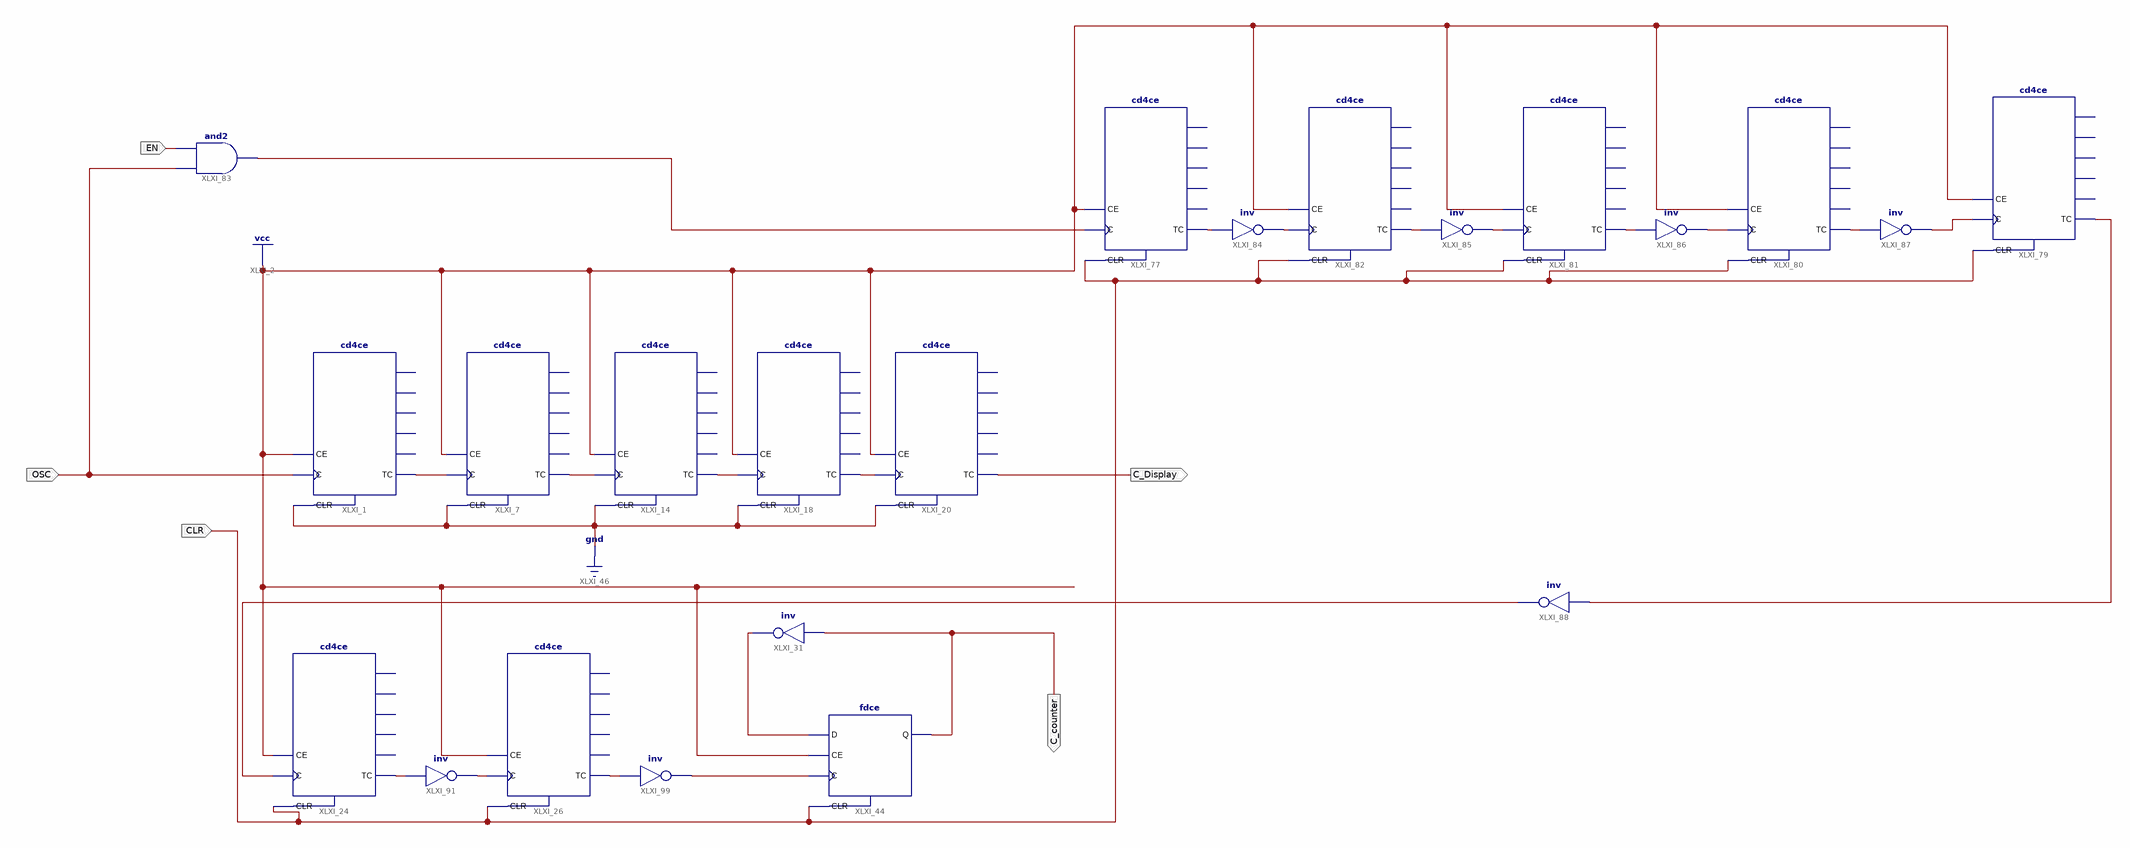
[diagram p0: schematic sheet 1]
// Xilinx ISE schematic DIVx.sch (spartan6) as structural Verilog: 22 symbols, 5 ports
module DIVx (
  input  CLR,
  input  OSC,
  input  EN,
  output C_counter,
  output C_Display
);

  wire XLXN_19, XLXN_20, XLXN_21, XLXN_22, XLXN_227, XLXN_228, XLXN_234, XLXN_235, XLXN_236, XLXN_237,
       XLXN_238, XLXN_239, XLXN_256, XLXN_257, XLXN_263, XLXN_284, XLXN_287, XLXN_288, XLXN_289, XLXN_292;

  cd4ce XLXI_24 (.C(XLXN_287), .CE(1'b1), .CLR(CLR), .TC(XLXN_256));  // open: CEO, Q0, Q1, Q2, Q3
  cd4ce XLXI_26 (.C(XLXN_257), .CE(1'b1), .CLR(CLR), .TC(XLXN_288));  // open: CEO, Q0, Q1, Q2, Q3
  cd4ce XLXI_7 (.C(XLXN_22), .CE(1'b1), .CLR(1'b0), .TC(XLXN_21));  // open: CEO, Q0, Q1, Q2, Q3
  cd4ce XLXI_14 (.C(XLXN_21), .CE(1'b1), .CLR(1'b0), .TC(XLXN_20));  // open: CEO, Q0, Q1, Q2, Q3
  cd4ce XLXI_18 (.C(XLXN_20), .CE(1'b1), .CLR(1'b0), .TC(XLXN_19));  // open: CEO, Q0, Q1, Q2, Q3
  cd4ce XLXI_20 (.C(XLXN_19), .CE(1'b1), .CLR(1'b0), .TC(C_Display));  // open: CEO, Q0, Q1, Q2, Q3
  cd4ce XLXI_1 (.C(OSC), .CE(1'b1), .CLR(1'b0), .TC(XLXN_22));  // open: CEO, Q0, Q1, Q2, Q3
  cd4ce XLXI_77 (.C(XLXN_292), .CE(1'b1), .CLR(CLR), .TC(XLXN_227));  // open: CEO, Q0, Q1, Q2, Q3
  cd4ce XLXI_79 (.C(XLXN_239), .CE(1'b1), .CLR(CLR), .TC(XLXN_263));  // open: CEO, Q0, Q1, Q2, Q3
  cd4ce XLXI_80 (.C(XLXN_237), .CE(1'b1), .CLR(CLR), .TC(XLXN_238));  // open: CEO, Q0, Q1, Q2, Q3
  cd4ce XLXI_81 (.C(XLXN_235), .CE(1'b1), .CLR(CLR), .TC(XLXN_236));  // open: CEO, Q0, Q1, Q2, Q3
  cd4ce XLXI_82 (.C(XLXN_228), .CE(1'b1), .CLR(CLR), .TC(XLXN_234));  // open: CEO, Q0, Q1, Q2, Q3
  and XLXI_83 (XLXN_292, OSC, EN);
  not XLXI_84 (XLXN_228, XLXN_227);
  not XLXI_85 (XLXN_235, XLXN_234);
  not XLXI_86 (XLXN_237, XLXN_236);
  not XLXI_88 (XLXN_287, XLXN_263);
  not XLXI_87 (XLXN_239, XLXN_238);
  not XLXI_91 (XLXN_257, XLXN_256);
  fdce XLXI_44 (.C(XLXN_289), .CE(1'b1), .CLR(CLR), .D(XLXN_284), .Q(C_counter));
  not XLXI_31 (XLXN_284, C_counter);
  not XLXI_99 (XLXN_289, XLXN_288);
endmodule
